# EAGLE schematic video-max5 (EAGLE 5.11)
DRAWN_BY: AlexiosC; PROJECT_NAME: CFT Mini-Computer VDU Card; REVISION: Rev F; SHEET_DESCRIPTION: Video Out; SIMULATION_FILENAME: video.v; URL: http://www.bedroomlan.org/cft

## Sheet 1 of 5
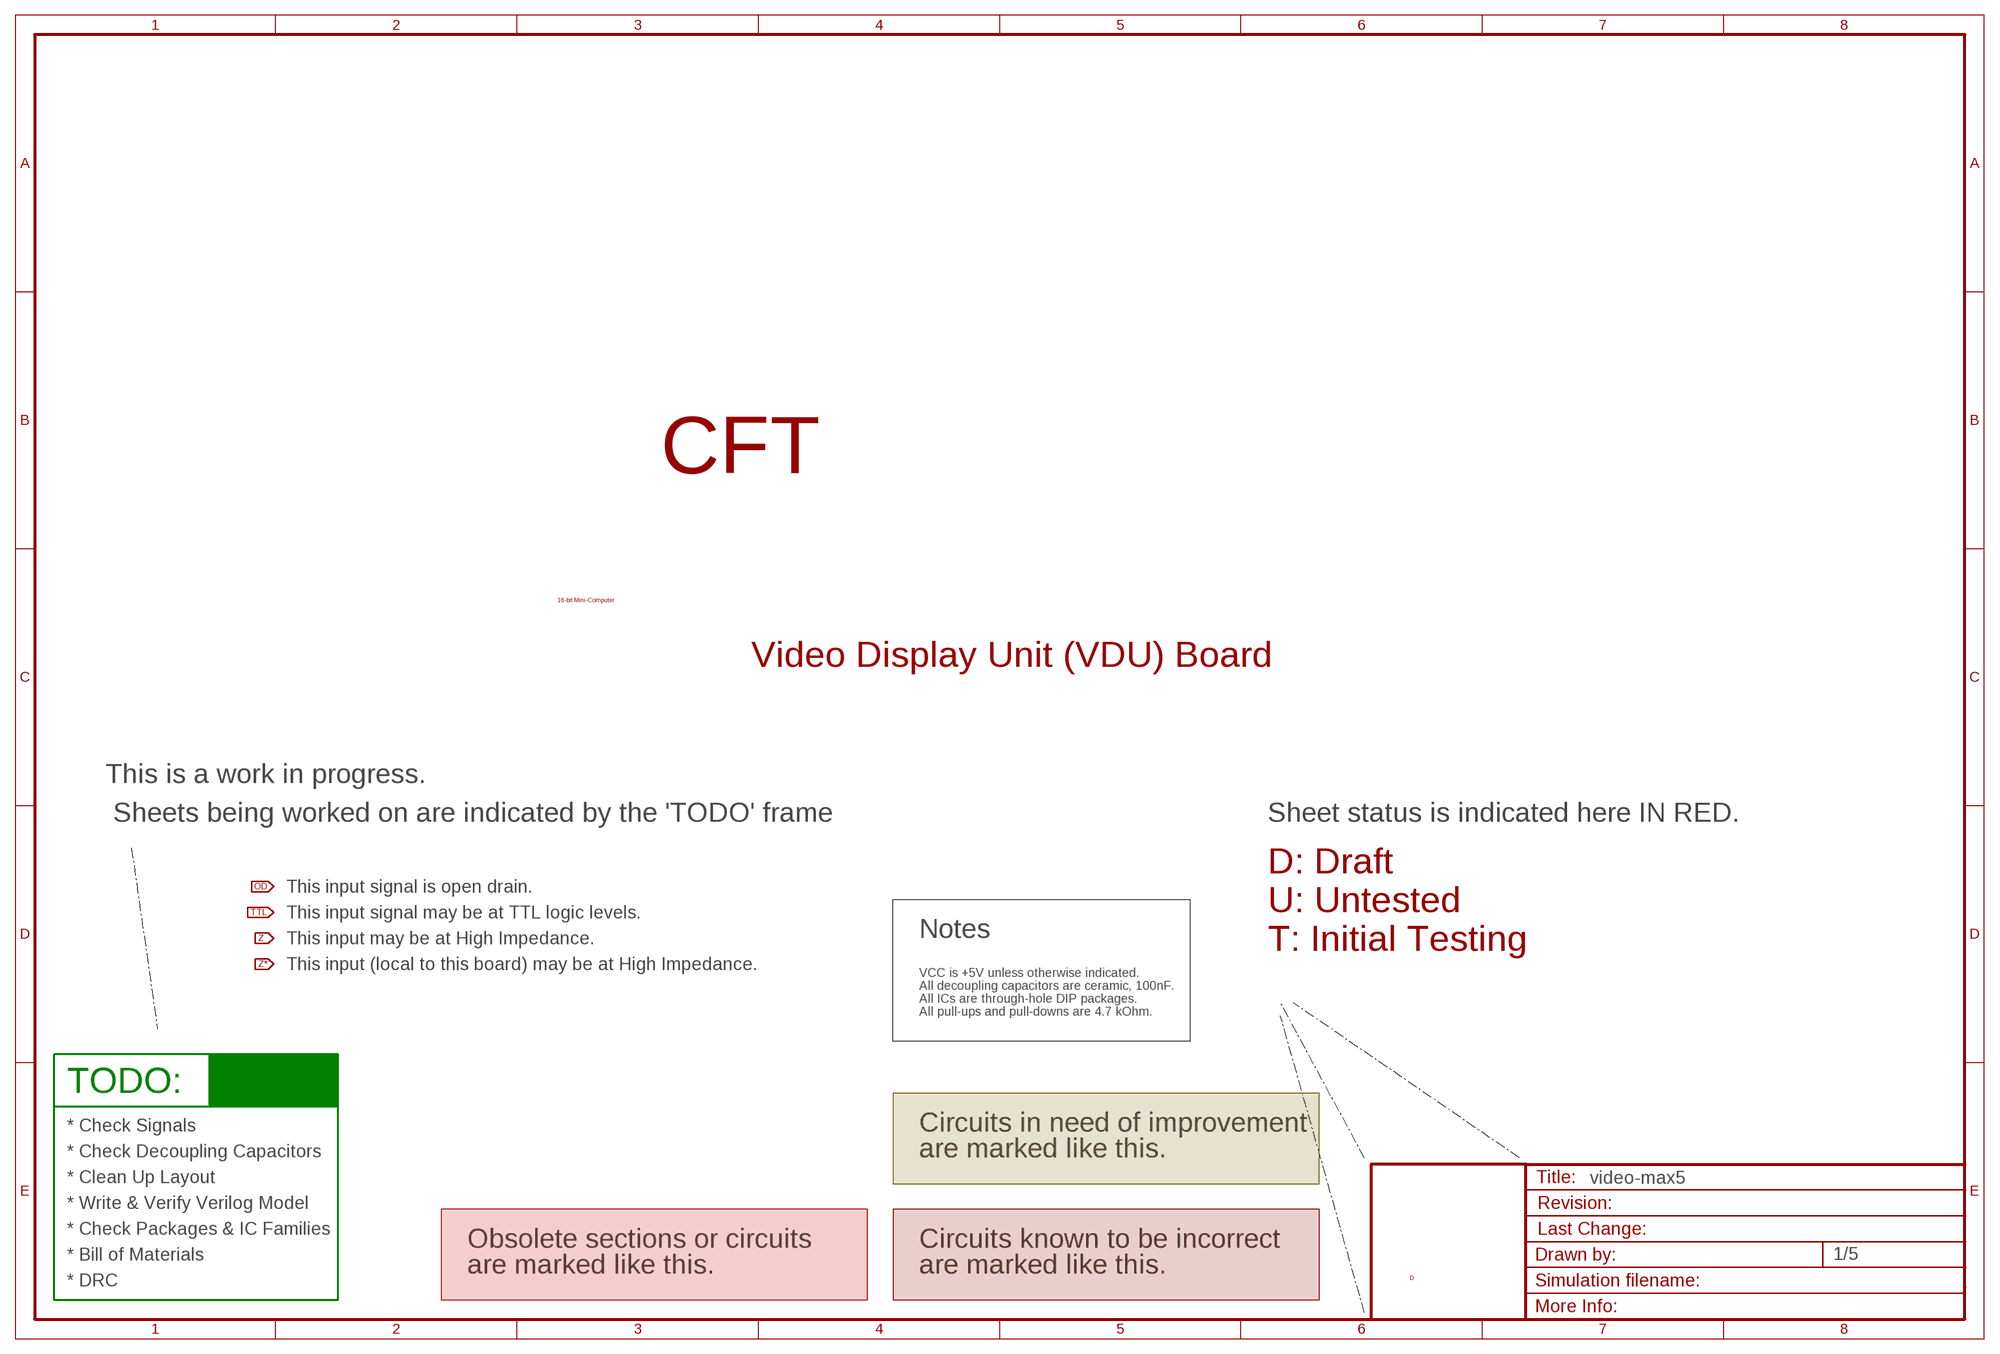
[diagram p0: schematic, sheet 1]

### Notes on the sheet
- CFT
- 16-bit Mini-Computer
- Video Display Unit (VDU) Board
- This is a work in progress.
- Sheets being worked on are indicated by the 'TODO' frame | Sheet status is indicated here IN RED.
- D: Draft
- This input signal is open drain.
- U: Untested
- This input signal may be at TTL logic levels.
- Notes
- This input may be at High Impedance.
- T: Initial Testing
- This input (local to this board) may be at High Impedance.
- VCC is +5V unless otherwise indicated.
- All decoupling capacitors are ceramic, 100nF. | C: Constructed and Tested
- All ICs are through-hole DIP packages.
- All pull-ups and pull-downs are 4.7 kOhm.
- TODO:
- * Check Signals | Circuits in need of improvement
- * Check Decoupling Capacitors | are marked like this.
- * Clean Up Layout
- * Write & Verify Verilog Model
- * Check Packages & IC Families
- Obsolete sections or circuits | Circuits known to be incorrect
- * Bill of Materials
- are marked like this. | are marked like this.
- D
- * DRC

## Sheet 2 of 5
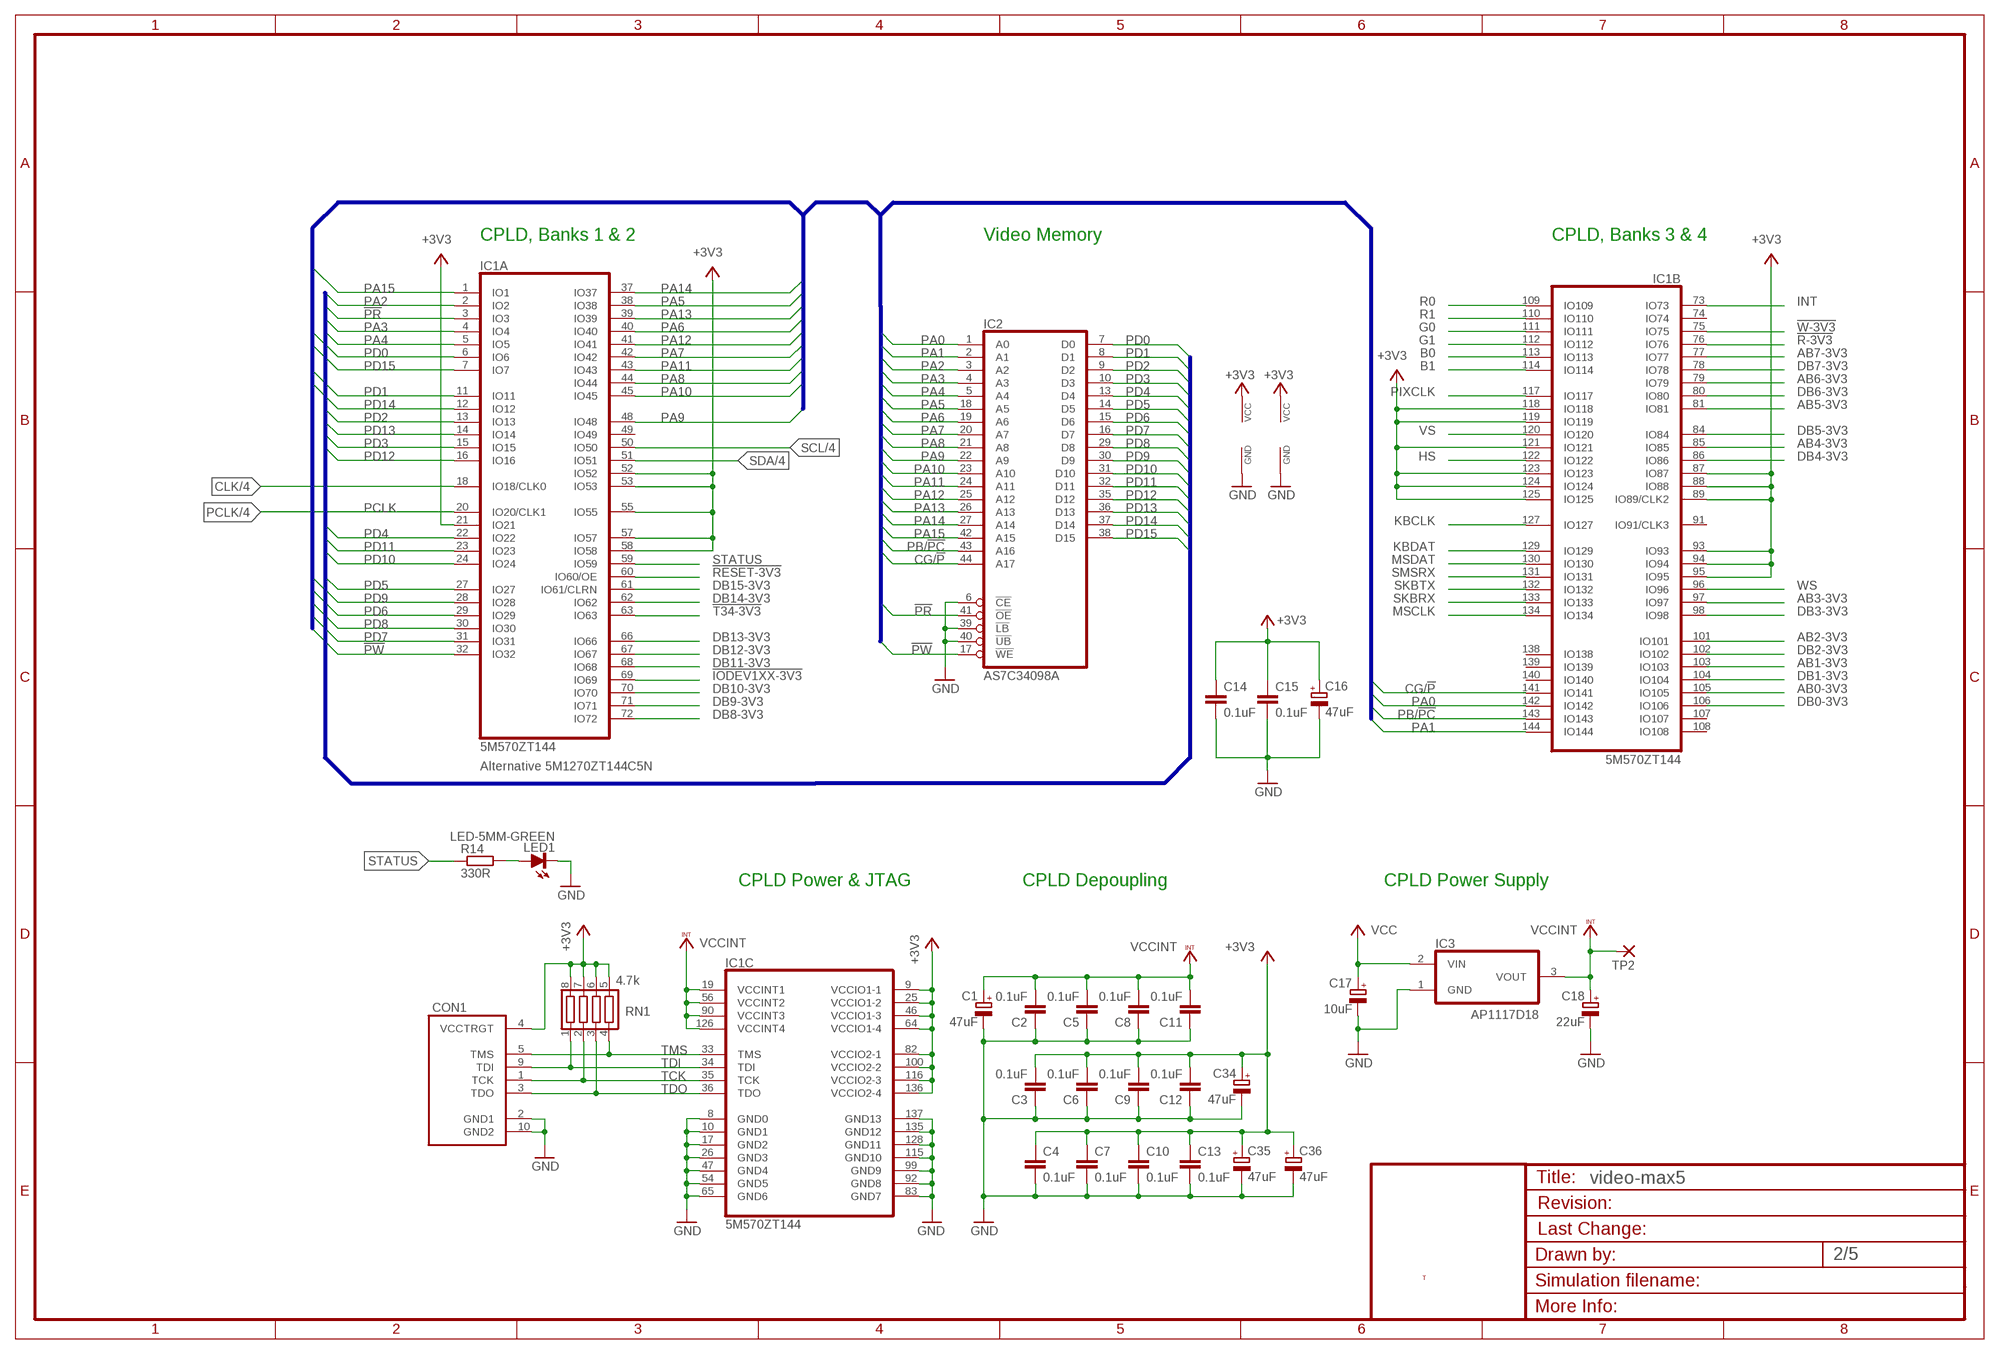
[diagram p1: schematic, sheet 2]

### Parts
C1  47uF  CPOL-EUE2-5  [E2-5]
C2  0.1uF  C-EUC0805K  [C0805K]
C3  0.1uF  C-EUC0805K  [C0805K]
C4  0.1uF  C-EUC0805K  [C0805K]
C5  0.1uF  C-EUC0805K  [C0805K]
C6  0.1uF  C-EUC0805K  [C0805K]
C7  0.1uF  C-EUC0805K  [C0805K]
C8  0.1uF  C-EUC0805K  [C0805K]
C9  0.1uF  C-EUC0805K  [C0805K]
C10  0.1uF  C-EUC0805K  [C0805K]
C11  0.1uF  C-EUC0805K  [C0805K]
C12  0.1uF  C-EUC0805K  [C0805K]
C13  0.1uF  C-EUC0805K  [C0805K]
C14  0.1uF  C-EUC0805K  [C0805K]
C15  0.1uF  C-EUC0805K  [C0805K]
C16  47uF  CPOL-EUE2-5  [E2-5]
C17  10uF  CPOL-EUE2-5  [E2-5]
C18  22uF  CPOL-EUE2-5  [E2-5]
C34  47uF  CPOL-EUE2-5  [E2-5]
C35  47uF  CPOL-EUE2-5  [E2-5]
C36  47uF  CPOL-EUE3.5-8  [E3,5-8]
CON1  JTAG-ALTERA  [SHROUDED-HEADER-2X5-2.5MM]
IC1  5M570ZT144  [TQFP144]
IC2  AS7C34098A  [SOJ44-4]
IC3  AP1117D18  [TO252]
LED1  LED-5MM-GREEN  LEDCHIPLED_0805  [CHIPLED_0805]
R14  330R  R-EU_R0805  [R0805]
RN1  4.7k  CTS742C083  [CTS742C083]
TP2  WIREPAD1,6/0,9  [1,6/0,9]

### Nets
!IODEV1XX-3V3: IC1.69(A:IO69) ; also sheet 4
!PR: IC1.3(A:IO3) IC2.41(!OE)
!PW: IC1.32(A:IO32) IC2.17(!WE)
!R-3V3: IC1.76(B:IO76) ; also sheet 4
!RESET-3V3: IC1.60(A:IO60/OE) ; also sheet 4
!T34-3V3: IC1.63(A:IO63)
!W-3V3: IC1.75(B:IO75) ; also sheet 4
+3V3: C3.2 C4.1 C6.2 C7.1 C9.2 C10.1 C12.2 C13.1 C14.1 C15.1 C16.+ C34.+ C35.+ C36.+ CON1.4(VCCTRGT) IC1.9(C:VCCIO1-1) IC1.21(A:IO21) IC1.25(C:VCCIO1-2) IC1.46(C:VCCIO1-3) IC1.52(A:IO52) IC1.53(A:IO53) IC1.55(A:IO55) IC1.57(A:IO57) IC1.58(A:IO58) IC1.64(C:VCCIO1-4) IC1.82(C:VCCIO2-1) IC1.87(B:IO87) IC1.88(B:IO88) IC1.89(B:IO89/CLK2) IC1.93(B:IO93) IC1.94(B:IO94) IC1.95(B:IO95) IC1.100(C:VCCIO2-2) IC1.116(C:VCCIO2-3) IC1.118(B:IO118) IC1.119(B:IO119) IC1.121(B:IO121) IC1.123(B:IO123) IC1.124(B:IO124) IC1.125(B:IO125) IC1.136(C:VCCIO2-4) IC2.11(VCC) IC2.33(VCC) RN1.5 RN1.6 RN1.7 RN1.8 ; also sheet 3,4,5
AB0-3V3: IC1.105(B:IO105) ; also sheet 4
AB1-3V3: IC1.103(B:IO103) ; also sheet 4
AB2-3V3: IC1.101(B:IO101) ; also sheet 4
AB3-3V3: IC1.97(B:IO97) ; also sheet 4
AB4-3V3: IC1.85(B:IO85) ; also sheet 4
AB5-3V3: IC1.81(B:IO81) ; also sheet 4
AB6-3V3: IC1.79(B:IO79) ; also sheet 4
AB7-3V3: IC1.77(B:IO77) ; also sheet 4
B0: IC1.113(B:IO113) ; also sheet 3
B1: IC1.114(B:IO114) ; also sheet 3
CG/!P!: IC1.141(B:IO141) IC2.44(A17)
CLK: IC1.18(A:IO18/CLK0) ; also sheet 4
DB0-3V3: IC1.106(B:IO106) ; also sheet 4
DB1-3V3: IC1.104(B:IO104) ; also sheet 4
DB2-3V3: IC1.102(B:IO102) ; also sheet 4
DB3-3V3: IC1.98(B:IO98) ; also sheet 4
DB4-3V3: IC1.86(B:IO86) ; also sheet 4
DB5-3V3: IC1.84(B:IO84) ; also sheet 4
DB6-3V3: IC1.80(B:IO80) ; also sheet 4
DB7-3V3: IC1.78(B:IO78) ; also sheet 4
DB8-3V3: IC1.72(A:IO72) ; also sheet 4
DB9-3V3: IC1.71(A:IO71) ; also sheet 4
DB10-3V3: IC1.70(A:IO70) ; also sheet 4
DB11-3V3: IC1.68(A:IO68) ; also sheet 4
DB12-3V3: IC1.67(A:IO67) ; also sheet 4
DB13-3V3: IC1.66(A:IO66) ; also sheet 4
DB14-3V3: IC1.62(A:IO62) ; also sheet 4
DB15-3V3: IC1.61(A:IO61/CLRN) ; also sheet 4
G0: IC1.111(B:IO111) ; also sheet 3
G1: IC1.112(B:IO112) ; also sheet 3
GND: C1.- C2.1 C3.1 C4.2 C5.1 C6.1 C7.2 C8.1 C9.1 C10.2 C11.1 C12.1 C13.2 C14.2 C15.2 C16.- C17.- C18.- C34.- C35.- C36.- CON1.2(GND1) CON1.10(GND2) IC1.8(C:GND0) IC1.10(C:GND1) IC1.17(C:GND2) IC1.26(C:GND3) IC1.47(C:GND4) IC1.54(C:GND5) IC1.65(C:GND6) IC1.83(C:GND7) IC1.92(C:GND8) IC1.99(C:GND9) IC1.115(C:GND10) IC1.128(C:GND11) IC1.135(C:GND12) IC1.137(C:GND13) IC2.6(!CE) IC2.12(GND) IC2.34(GND) IC2.39(!LB) IC2.40(!UB) IC3.1(GND) LED1.C ; also sheet 3,4,5
HS: IC1.122(B:IO122) ; also sheet 3
INT: IC1.73(B:IO73) ; also sheet 4
KBCLK: IC1.127(B:IO127) ; also sheet 4
KBDAT: IC1.129(B:IO129) ; also sheet 4
MSCLK: IC1.134(B:IO134) ; also sheet 4
MSDAT: IC1.130(B:IO130) ; also sheet 4
N$341: LED1.A R14.2
PA0: IC1.142(B:IO142) IC2.1(A0)
PA1: IC1.144(B:IO144) IC2.2(A1)
PA2: IC1.2(A:IO2) IC2.3(A2)
PA3: IC1.4(A:IO4) IC2.4(A3)
PA4: IC1.5(A:IO5) IC2.5(A4)
PA5: IC1.38(A:IO38) IC2.18(A5)
PA6: IC1.40(A:IO40) IC2.19(A6)
PA7: IC1.42(A:IO42) IC2.20(A7)
PA8: IC1.44(A:IO44) IC2.21(A8)
PA9: IC1.48(A:IO48) IC2.22(A9)
PA10: IC1.45(A:IO45) IC2.23(A10)
PA11: IC1.43(A:IO43) IC2.24(A11)
PA12: IC1.41(A:IO41) IC2.25(A12)
PA13: IC1.39(A:IO39) IC2.26(A13)
PA14: IC1.37(A:IO37) IC2.27(A14)
PA15: IC1.1(A:IO1) IC2.42(A15)
PB/!PC!: IC1.143(B:IO143) IC2.43(A16)
PCLK: IC1.20(A:IO20/CLK1) ; also sheet 4
PD0: IC1.6(A:IO6) IC2.7(D0)
PD1: IC1.11(A:IO11) IC2.8(D1)
PD2: IC1.13(A:IO13) IC2.9(D2)
PD3: IC1.15(A:IO15) IC2.10(D3)
PD4: IC1.22(A:IO22) IC2.13(D4)
PD5: IC1.27(A:IO27) IC2.14(D5)
PD6: IC1.29(A:IO29) IC2.15(D6)
PD7: IC1.31(A:IO31) IC2.16(D7)
PD8: IC1.30(A:IO30) IC2.29(D8)
PD9: IC1.28(A:IO28) IC2.30(D9)
PD10: IC1.24(A:IO24) IC2.31(D10)
PD11: IC1.23(A:IO23) IC2.32(D11)
PD12: IC1.16(A:IO16) IC2.35(D12)
PD13: IC1.14(A:IO14) IC2.36(D13)
PD14: IC1.12(A:IO12) IC2.37(D14)
PD15: IC1.7(A:IO7) IC2.38(D15)
PIXCLK: IC1.117(B:IO117) ; also sheet 3
R0: IC1.109(B:IO109) ; also sheet 3
R1: IC1.110(B:IO110) ; also sheet 3
SCL: IC1.50(A:IO50) ; also sheet 4
SDA: IC1.51(A:IO51) ; also sheet 4
SKBRX: IC1.133(B:IO133) ; also sheet 4
SKBTX: IC1.132(B:IO132) ; also sheet 4
SMSRX: IC1.131(B:IO131) ; also sheet 4
STATUS: IC1.59(A:IO59) R14.1
TCK: CON1.1(TCK) IC1.35(C:TCK) RN1.2
TDI: CON1.9(TDI) IC1.34(C:TDI) RN1.1
TDO: CON1.3(TDO) IC1.36(C:TDO) RN1.3
TMS: CON1.5(TMS) IC1.33(C:TMS) RN1.4
VCC: C17.+ IC3.2(VIN) ; also sheet 3,4,5
VCCINT: C1.+ C2.2 C5.2 C8.2 C11.2 C18.+ IC1.19(C:VCCINT1) IC1.56(C:VCCINT2) IC1.90(C:VCCINT3) IC1.126(C:VCCINT4) IC3.3(VOUT) TP2.1(P)
VS: IC1.120(B:IO120) ; also sheet 3
WS: IC1.96(B:IO96) ; also sheet 4
Unconnected: IC1.49(A:IO49) IC1.74(B:IO74) IC1.91(B:IO91/CLK3) IC1.107(B:IO107) IC1.108(B:IO108) IC1.138(B:IO138) IC1.139(B:IO139) IC1.140(B:IO140)

### Buses
PD[0..23]
PA[0..15],PB/!PC!,CG/!P!,!PR,!PW

### Notes on the sheet
- CPLD, Banks 1 & 2 | Video Memory | CPLD, Banks 3 & 4
- Alternative 5M1270ZT144C5N
- CPLD Power & JTAG | CPLD Depoupling | CPLD Power Supply
- T

## Sheet 3 of 5
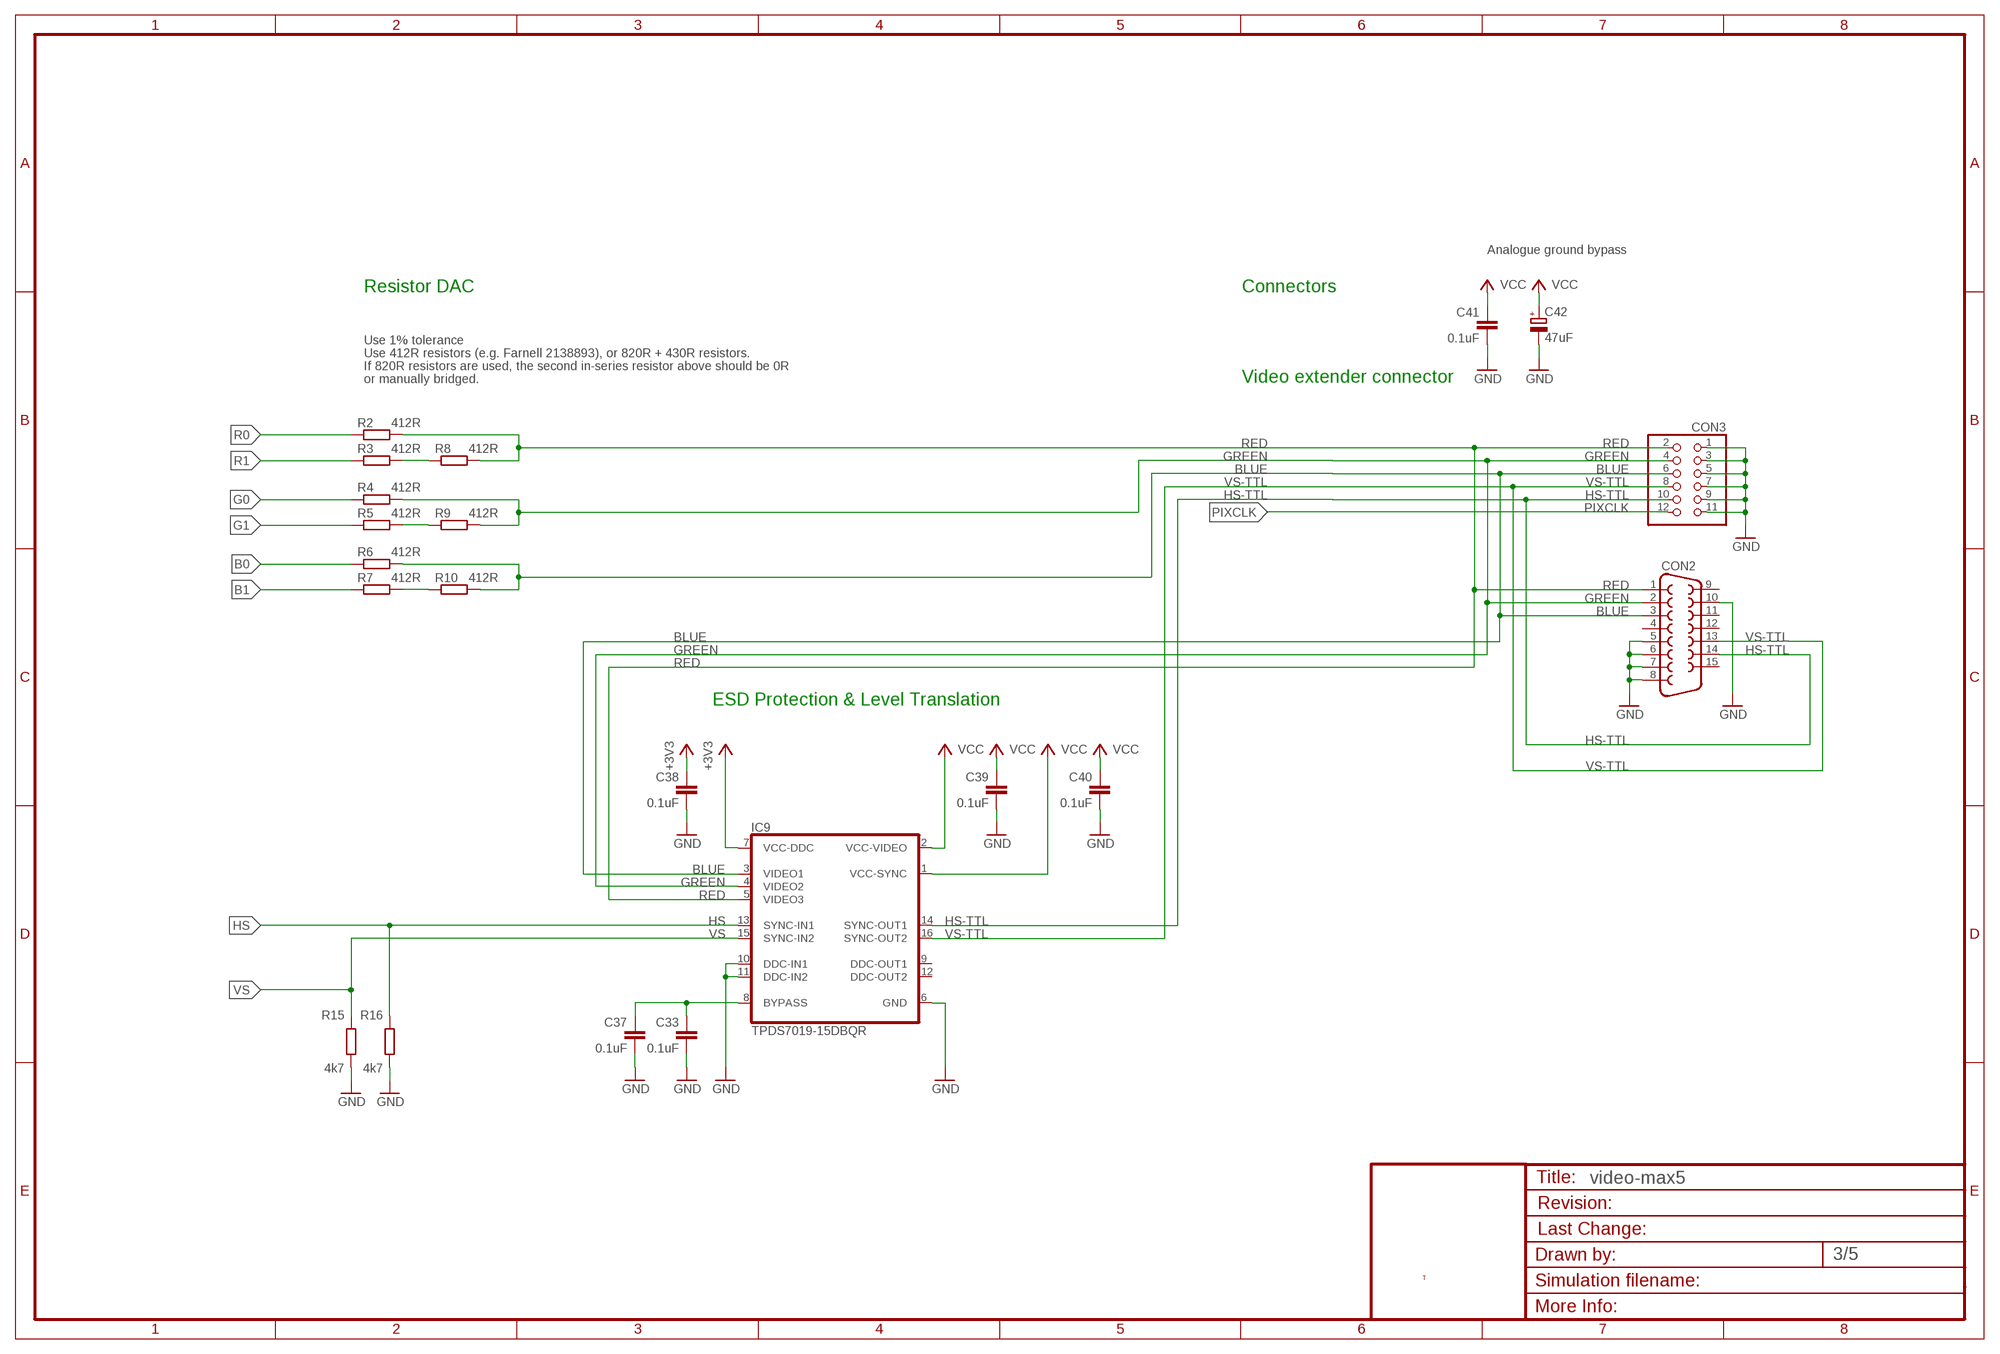
[diagram p2: schematic, sheet 3]

### Parts
C33  0.1uF  C-EUC0805K  [C0805K]
C37  0.1uF  C-EUC0805K  [C0805K]
C38  0.1uF  C-EUC0805K  [C0805K]
C39  0.1uF  C-EUC0805K  [C0805K]
C40  0.1uF  C-EUC0805K  [C0805K]
C41  0.1uF  C-EUC0805K  [C0805K]
C42  47uF  CPOL-EUE2-5  [E2-5]
CON2  F15HDH  [HDF15H]
CON3  PINHD-2X6  [2X06]
IC9  TPDS7019-15DBQR  [SSOP16]
R2  412R  R-EU_R0805  [R0805]
R3  412R  R-EU_R0805  [R0805]
R4  412R  R-EU_R0805  [R0805]
R5  412R  R-EU_R0805  [R0805]
R6  412R  R-EU_R0805  [R0805]
R7  412R  R-EU_R0805  [R0805]
R8  412R  R-EU_R0805  [R0805]
R9  412R  R-EU_R0805  [R0805]
R10  412R  R-EU_R0805  [R0805]
R15  4k7  R-EU_R0805  [R0805]
R16  4k7  R-EU_R0805  [R0805]

### Nets
+3V3: C38.1 IC9.7(VCC-DDC) ; also sheet 2,4,5
B0: R6.1 ; also sheet 2
B1: R7.1 ; also sheet 2
BLUE [Analogue]: CON2.3 CON3.6 IC9.3(VIDEO1) R6.2 R10.2
G0: R4.1 ; also sheet 2
G1: R5.1 ; also sheet 2
GND: C33.2 C37.2 C38.2 C39.2 C40.2 C41.2 C42.- CON2.5 CON2.6 CON2.7 CON2.8 CON2.10 CON3.1 CON3.3 CON3.5 CON3.7 CON3.9 CON3.11 IC9.6(GND) IC9.10(DDC-IN1) IC9.11(DDC-IN2) R15.1 R16.1 ; also sheet 2,4,5
GREEN [Analogue]: CON2.2 CON3.4 IC9.4(VIDEO2) R4.2 R9.2
HS: IC9.13(SYNC-IN1) R16.2 ; also sheet 2
HS-TTL: CON2.14 CON3.10 IC9.14(SYNC-OUT1)
N$1: R3.2 R8.1
N$2: R5.2 R9.1
N$3: R7.2 R10.1
N$6: C33.1 C37.1 IC9.8(BYPASS)
PIXCLK: CON3.12 ; also sheet 2
R0: R2.1 ; also sheet 2
R1: R3.1 ; also sheet 2
RED [Analogue]: CON2.1 CON3.2 IC9.5(VIDEO3) R2.2 R8.2
VCC: C39.1 C40.1 C41.1 C42.+ IC9.1(VCC-SYNC) IC9.2(VCC-VIDEO) ; also sheet 2,4,5
VS: IC9.15(SYNC-IN2) R15.2 ; also sheet 2
VS-TTL: CON2.13 CON3.8 IC9.16(SYNC-OUT2)
Unconnected: CON2.4 CON2.9 CON2.11 CON2.12 CON2.15 IC9.9(DDC-OUT1) IC9.12(DDC-OUT2)

### Notes on the sheet
- Analogue ground bypass
- Resistor DAC | Connectors
- Use 1% tolerance
- Use 412R resistors (e.g. Farnell 2138893), or 820R + 430R resistors.
- If 820R resistors are used, the second in-series resistor above should be 0R
- or manually bridged. | Video extender connector
- ESD Protection & Level Translation
- T

## Sheet 4 of 5
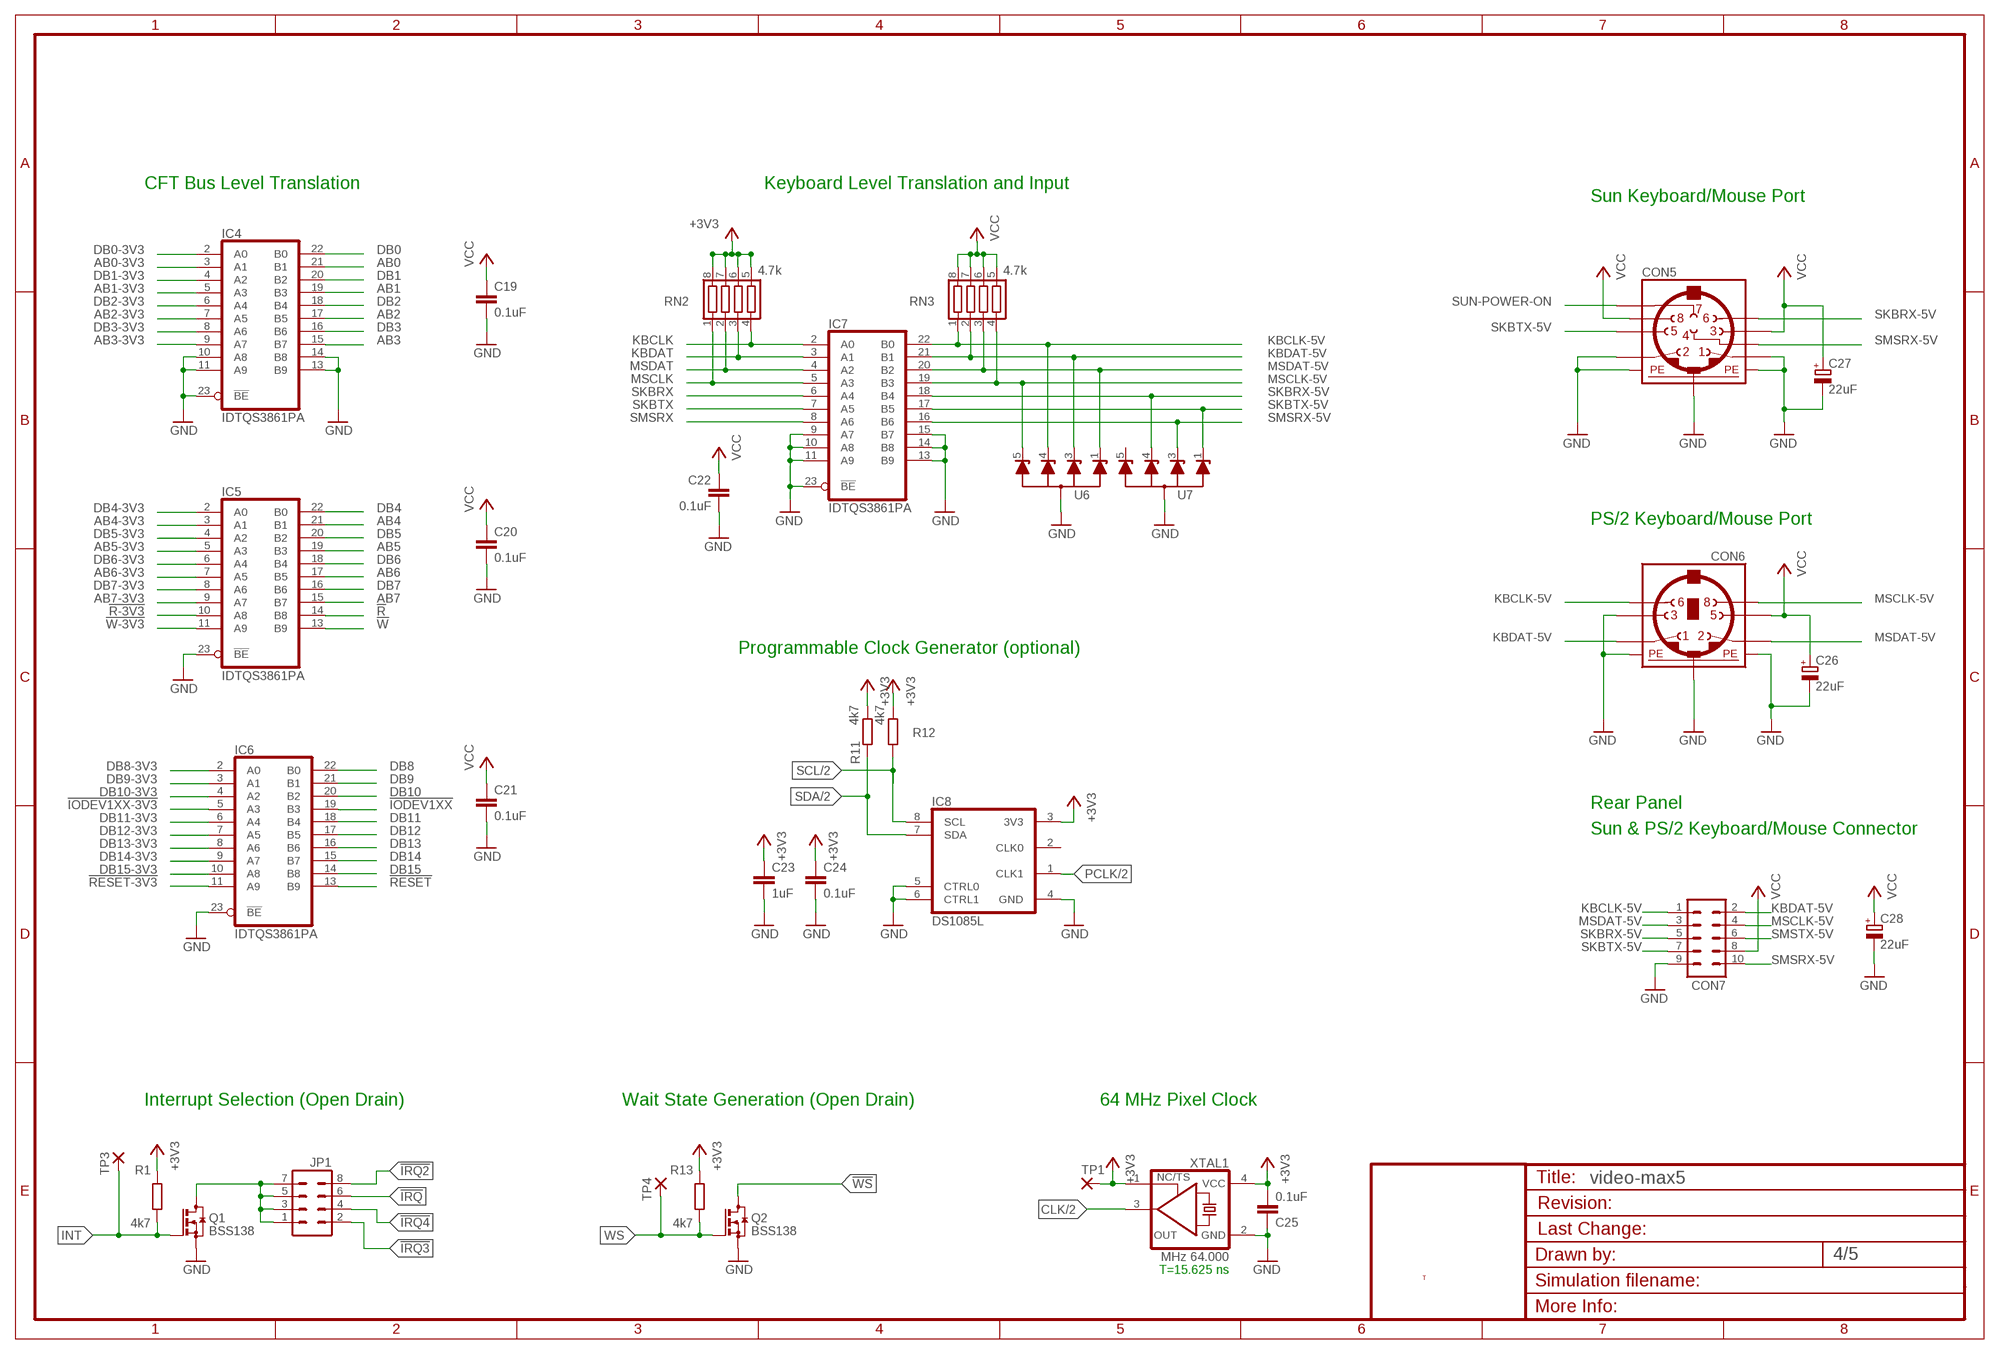
[diagram p3: schematic, sheet 4]

### Parts
C19  0.1uF  C-EUC0805K  [C0805K]
C20  0.1uF  C-EUC0805K  [C0805K]
C21  0.1uF  C-EUC0805K  [C0805K]
C22  0.1uF  C-EUC0805K  [C0805K]
C23  1uF  C-EUC0805K  [C0805K]
C24  0.1uF  C-EUC0805K  [C0805K]
C25  0.1uF  C-EUC0805K  [C0805K]
C26  22uF  CPOL-EUE2-5  [E2-5]
C27  22uF  CPOL-EUE2-5  [E2-5]
C28  22uF  CPOL-EUE2-5  [E2-5]
CON5  MINI_DIN_8  [M_DIN8]
CON6  MINI_DIN_6  [M_DIN6]
CON7  MA05-2  [MA05-2]
IC4  IDTQS3861PA  [TSSOP24]
IC5  IDTQS3861PA  [TSSOP24]
IC6  IDTQS3861PA  [TSSOP24]
IC7  IDTQS3861PA  [TSSOP24]
IC8  DS1085L  [SO08]
JP1  MA04-2  [MA04-2]
Q1  BSS138  [SOT23]
Q2  BSS138  [SOT23]
R1  4k7  R-EU_R0805  [R0805]
R11  4k7  R-EU_R0805  [R0805]
R12  4k7  R-EU_R0805  [R0805]
R13  4k7  R-EU_R0805  [R0805]
RN2  4.7k  CTS742C083  [CTS742C083]
RN3  4.7k  CTS742C083  [CTS742C083]
TP1  WIREPAD1,6/0,9  [1,6/0,9]
TP3  WIREPAD1,6/0,9  [1,6/0,9]
TP4  WIREPAD1,6/0,9  [1,6/0,9]
U6  BZA856AVL  [SC70-5]
U7  BZA856AVL  [SC70-5]
XTAL1  64.000  XO-SMD-5X3.2  [CRYSTAL-SMD-5X3.2MM]

### Nets
!IODEV1XX: IC6.19(B3) ; also sheet 5
!IODEV1XX-3V3: IC6.5(A3) ; also sheet 2
!IRQ: JP1.6 ; also sheet 5
!IRQ2: JP1.8 ; also sheet 5
!IRQ3: JP1.2 ; also sheet 5
!IRQ4: JP1.4 ; also sheet 5
!R: IC5.14(B8) ; also sheet 5
!R-3V3: IC5.10(A8) ; also sheet 2
!RESET: IC6.13(B9) ; also sheet 5
!RESET-3V3: IC6.11(A9) ; also sheet 2
!W: IC5.13(B9) ; also sheet 5
!W-3V3: IC5.11(A9) ; also sheet 2
!WS: Q2.3(D) ; also sheet 5
+3V3: C23.1 C24.1 C25.2 IC8.3(3V3) R1.2 R11.2 R12.2 R13.2 RN2.5 RN2.6 RN2.7 RN2.8 TP1.1(P) XTAL1.1(TS) XTAL1.4(VCC) ; also sheet 2,3,5
AB0: IC4.21(B1) ; also sheet 5
AB0-3V3: IC4.3(A1) ; also sheet 2
AB1: IC4.19(B3) ; also sheet 5
AB1-3V3: IC4.5(A3) ; also sheet 2
AB2: IC4.17(B5) ; also sheet 5
AB2-3V3: IC4.7(A5) ; also sheet 2
AB3: IC4.15(B7) ; also sheet 5
AB3-3V3: IC4.9(A7) ; also sheet 2
AB4: IC5.21(B1) ; also sheet 5
AB4-3V3: IC5.3(A1) ; also sheet 2
AB5: IC5.19(B3) ; also sheet 5
AB5-3V3: IC5.5(A3) ; also sheet 2
AB6: IC5.17(B5) ; also sheet 5
AB6-3V3: IC5.7(A5) ; also sheet 2
AB7: IC5.15(B7) ; also sheet 5
AB7-3V3: IC5.9(A7) ; also sheet 2
CLK: XTAL1.3(OUT) ; also sheet 2
DB0: IC4.22(B0) ; also sheet 5
DB0-3V3: IC4.2(A0) ; also sheet 2
DB1: IC4.20(B2) ; also sheet 5
DB1-3V3: IC4.4(A2) ; also sheet 2
DB2: IC4.18(B4) ; also sheet 5
DB2-3V3: IC4.6(A4) ; also sheet 2
DB3: IC4.16(B6) ; also sheet 5
DB3-3V3: IC4.8(A6) ; also sheet 2
DB4: IC5.22(B0) ; also sheet 5
DB4-3V3: IC5.2(A0) ; also sheet 2
DB5: IC5.20(B2) ; also sheet 5
DB5-3V3: IC5.4(A2) ; also sheet 2
DB6: IC5.18(B4) ; also sheet 5
DB6-3V3: IC5.6(A4) ; also sheet 2
DB7: IC5.16(B6) ; also sheet 5
DB7-3V3: IC5.8(A6) ; also sheet 2
DB8: IC6.22(B0) ; also sheet 5
DB8-3V3: IC6.2(A0) ; also sheet 2
DB9: IC6.21(B1) ; also sheet 5
DB9-3V3: IC6.3(A1) ; also sheet 2
DB10: IC6.20(B2) ; also sheet 5
DB10-3V3: IC6.4(A2) ; also sheet 2
DB11: IC6.18(B4) ; also sheet 5
DB11-3V3: IC6.6(A4) ; also sheet 2
DB12: IC6.17(B5) ; also sheet 5
DB12-3V3: IC6.7(A5) ; also sheet 2
DB13: IC6.16(B6) ; also sheet 5
DB13-3V3: IC6.8(A6) ; also sheet 2
DB14: IC6.15(B7) ; also sheet 5
DB14-3V3: IC6.9(A7) ; also sheet 2
DB15: IC6.14(B8) ; also sheet 5
DB15-3V3: IC6.10(A8) ; also sheet 2
GND: C19.2 C20.2 C21.2 C22.2 C23.2 C24.2 C25.1 C26.- C27.- C28.- CON5.1 CON5.2 CON5.SH1(PE1) CON5.SH2(PE2) CON5.SH3(PE3) CON6.3 CON6.SH1(PE1) CON6.SH2(PE2) CON6.SH3(PE3) CON7.9 IC4.10(A8) IC4.11(A9) IC4.13(B9) IC4.14(B8) IC4.23(!BE) IC5.23(!BE) IC6.23(!BE) IC7.9(A7) IC7.10(A8) IC7.11(A9) IC7.13(B9) IC7.14(B8) IC7.15(B7) IC7.23(!BE) IC8.4(GND) IC8.5(CTRL0) IC8.6(CTRL1) Q1.2(S) Q2.2(S) U6.2(G) U7.2(G) XTAL1.2(GND) ; also sheet 2,3,5
INT: Q1.1(G) R1.1 TP3.1(P) ; also sheet 2
KBCLK: IC7.2(A0) RN2.4 ; also sheet 2
KBCLK-5V: CON6.6 CON7.1 IC7.22(B0) RN3.1 U6.4
KBDAT: IC7.3(A1) RN2.3 ; also sheet 2
KBDAT-5V: CON6.1 CON7.2 IC7.21(B1) RN3.2 U6.3
MSCLK: IC7.5(A3) RN2.1 ; also sheet 2
MSCLK-5V: CON6.8 CON7.4 IC7.19(B3) RN3.4 U6.5
MSDAT: IC7.4(A2) RN2.2 ; also sheet 2
MSDAT-5V: CON6.2 CON7.3 IC7.20(B2) RN3.3 U6.1
N$4: JP1.1 JP1.3 JP1.5 JP1.7 Q1.3(D)
PCLK: IC8.1(CLK1) ; also sheet 2
SCL: IC8.8(SCL) R12.1 ; also sheet 2
SDA: IC8.7(SDA) R11.1 ; also sheet 2
SKBRX: IC7.6(A4) ; also sheet 2
SKBRX-5V: CON5.6 CON7.5 IC7.18(B4) U7.4
SKBTX: IC7.7(A5) ; also sheet 2
SKBTX-5V: CON5.5 CON7.7 IC7.17(B5) U7.1
SMSRX: IC7.8(A6) ; also sheet 2
SMSRX-5V: CON5.4 CON7.10 IC7.16(B6) U7.3
SMSTX-5V: CON7.6
SUN-POWER-ON: CON5.7
VCC: C19.1 C20.1 C21.1 C22.1 C26.+ C27.+ C28.+ CON5.3 CON5.8 CON6.5 CON7.8 RN3.5 RN3.6 RN3.7 RN3.8 ; also sheet 2,3,5
WS: Q2.1(G) R13.1 TP4.1(P) ; also sheet 2
Unconnected: IC8.2(CLK0) U7.5

### Notes on the sheet
- CFT Bus Level Translation | Keyboard Level Translation and Input
- Sun Keyboard/Mouse Port
- PS/2 Keyboard/Mouse Port
- Programmable Clock Generator (optional)
- Rear Panel
- Sun & PS/2 Keyboard/Mouse Connector
- Interrupt Selection (Open Drain) | Wait State Generation (Open Drain) | 64 MHz Pixel Clock
- MHz
- T=15.625 ns
- T

## Sheet 5 of 5
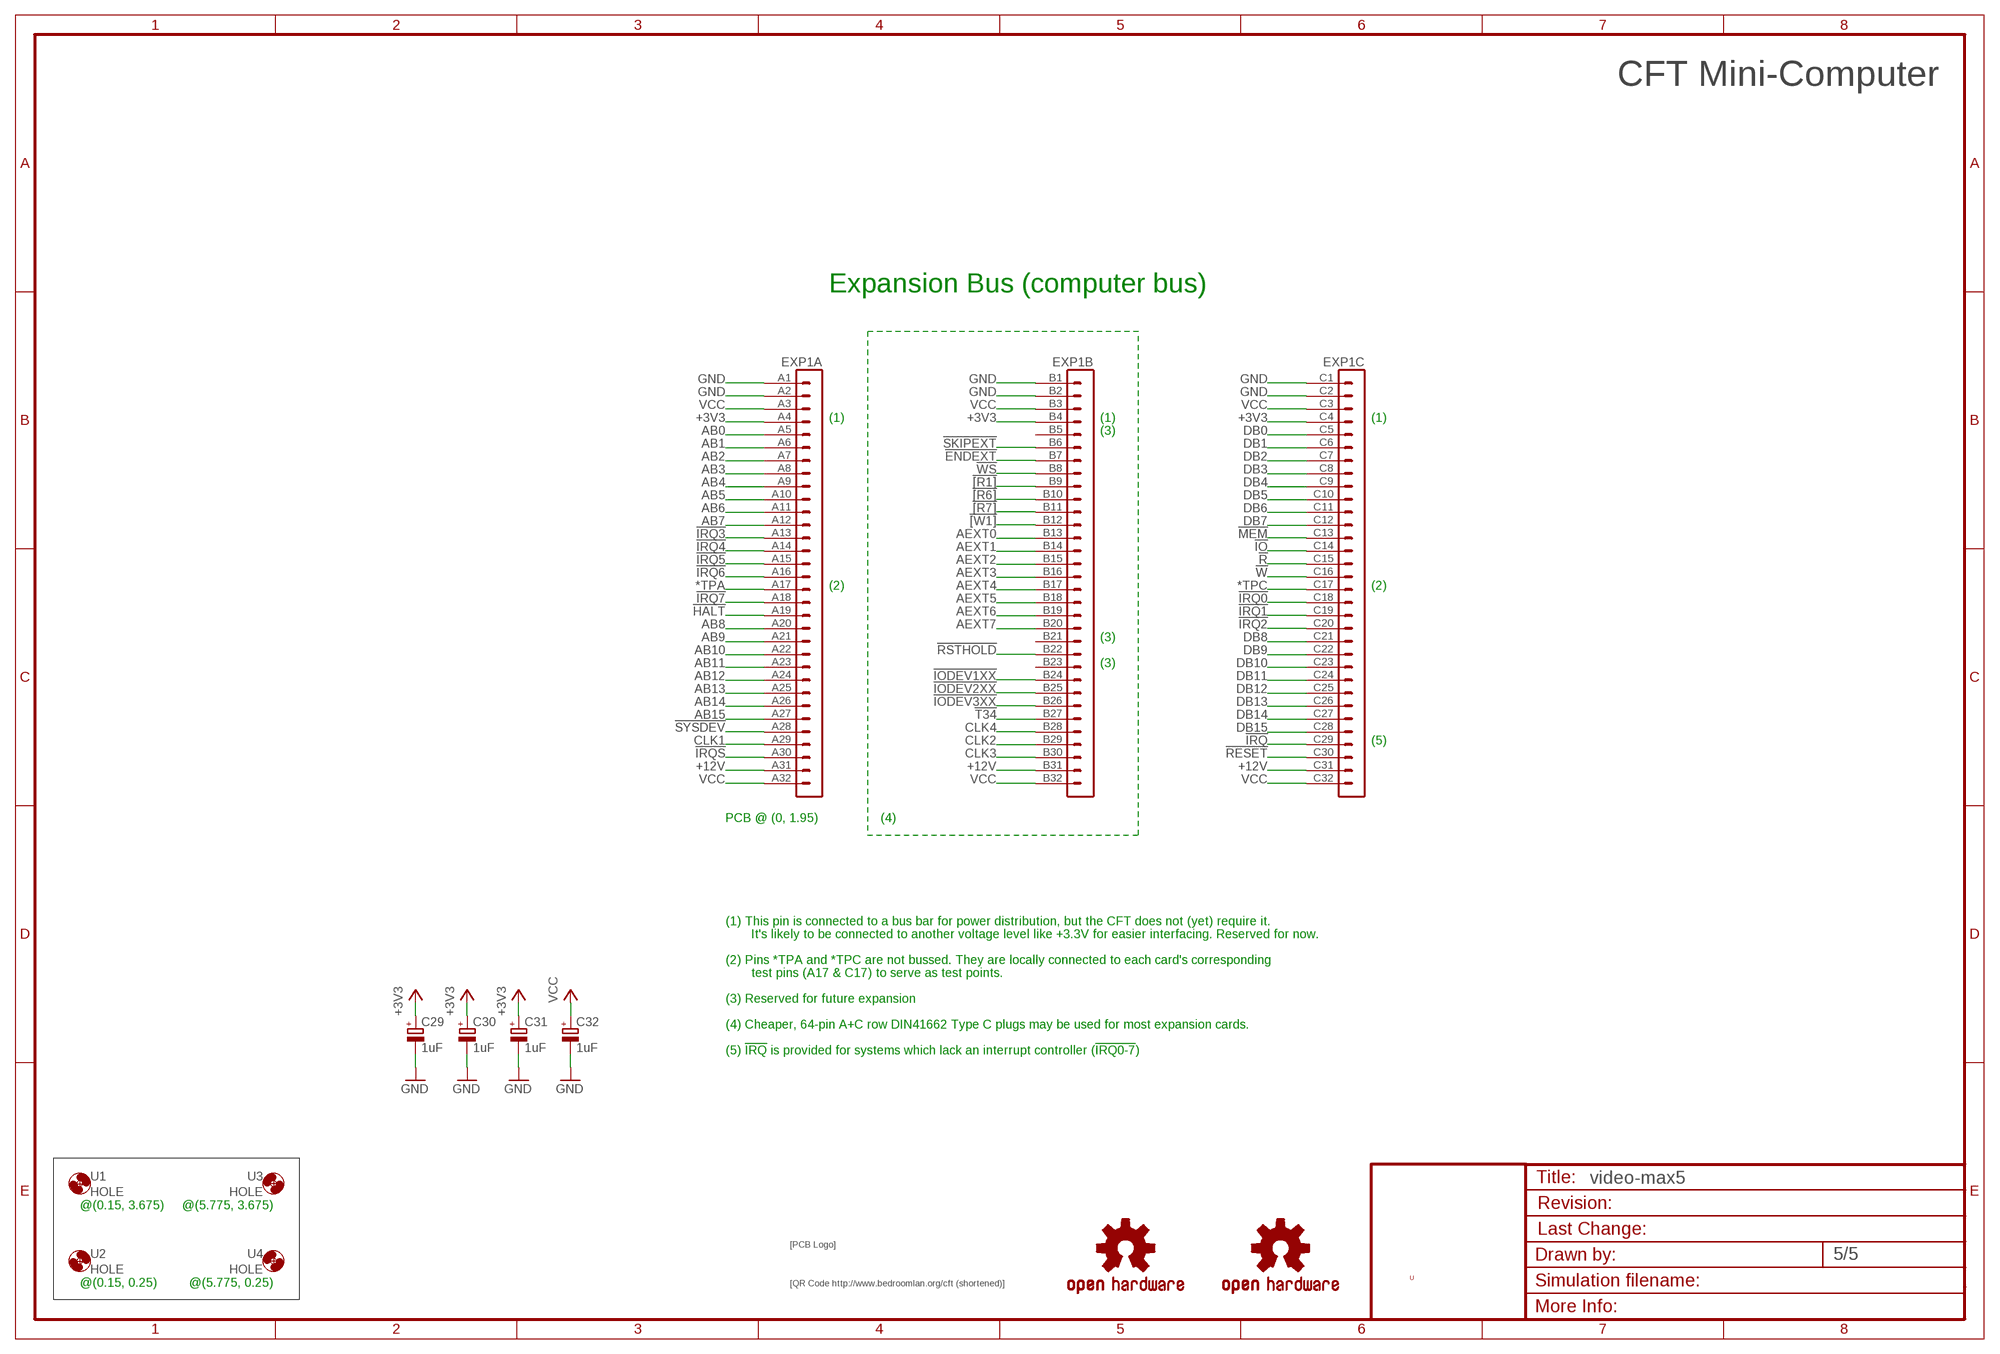
[diagram p4: schematic, sheet 5]

### Parts
$4_37_$1  SIGNATURESILK  [SIGNATURE]
$4_39_$  OSHW-LOGOL  [OSHW-LOGO-L]
$4_39_$1  OSHW-LOGOL  [OSHW-LOGO-L]
$4_40_$  QRCODE-CFT  [CFT-QRCODE]
C29  1uF  CPOL-EUE2.5-5  [E2,5-5]
C30  1uF  CPOL-EUE2.5-5  [E2,5-5]
C31  1uF  CPOL-EUE2.5-5  [E2,5-5]
C32  1uF  CPOL-EUE2.5-5  [E2,5-5]
EXP1  VG96-3K  [VG96K]
U1  HOLE  [STANDOFF_28_60]
U2  HOLE  [STANDOFF_28_60]
U3  HOLE  [STANDOFF_28_60]
U4  HOLE  [STANDOFF_28_60]

### Nets
![R1]: EXP1.B9
![R6]: EXP1.B10
![R7]: EXP1.B11
![W1]: EXP1.B12
!ENDEXT: EXP1.B7
!HALT: EXP1.A19
!IO: EXP1.C14
!IODEV1XX: EXP1.B24 ; also sheet 4
!IODEV2XX: EXP1.B25
!IODEV3XX: EXP1.B26
!IRQ: EXP1.C29 ; also sheet 4
!IRQ0: EXP1.C18
!IRQ1: EXP1.C19
!IRQ2: EXP1.C20 ; also sheet 4
!IRQ3: EXP1.A13 ; also sheet 4
!IRQ4: EXP1.A14 ; also sheet 4
!IRQ5: EXP1.A15
!IRQ6: EXP1.A16
!IRQ7: EXP1.A18
!IRQS: EXP1.A30
!MEM: EXP1.C13
!R: EXP1.C15 ; also sheet 4
!RESET: EXP1.C30 ; also sheet 4
!RSTHOLD: EXP1.B22
!SKIPEXT: EXP1.B6
!SYSDEV: EXP1.A28
!T34: EXP1.B27
!W: EXP1.C16 ; also sheet 4
!WS: EXP1.B8 ; also sheet 4
*TPA: EXP1.A17
*TPC: EXP1.C17
+3V3: C29.+ C30.+ C31.+ EXP1.A4 EXP1.B4 EXP1.C4 ; also sheet 2,3,4
+12V [Power Rail]: EXP1.A31 EXP1.B31 EXP1.C31
AB0: EXP1.A5 ; also sheet 4
AB1: EXP1.A6 ; also sheet 4
AB2: EXP1.A7 ; also sheet 4
AB3: EXP1.A8 ; also sheet 4
AB4: EXP1.A9 ; also sheet 4
AB5: EXP1.A10 ; also sheet 4
AB6: EXP1.A11 ; also sheet 4
AB7: EXP1.A12 ; also sheet 4
AB8: EXP1.A20
AB9: EXP1.A21
AB10: EXP1.A22
AB11: EXP1.A23
AB12: EXP1.A24
AB13: EXP1.A25
AB14: EXP1.A26
AB15: EXP1.A27
AEXT0: EXP1.B13
AEXT1: EXP1.B14
AEXT2: EXP1.B15
AEXT3: EXP1.B16
AEXT4: EXP1.B17
AEXT5: EXP1.B18
AEXT6: EXP1.B19
AEXT7: EXP1.B20
CLK1: EXP1.A29
CLK2: EXP1.B29
CLK3: EXP1.B30
CLK4: EXP1.B28
DB0: EXP1.C5 ; also sheet 4
DB1: EXP1.C6 ; also sheet 4
DB2: EXP1.C7 ; also sheet 4
DB3: EXP1.C8 ; also sheet 4
DB4: EXP1.C9 ; also sheet 4
DB5: EXP1.C10 ; also sheet 4
DB6: EXP1.C11 ; also sheet 4
DB7: EXP1.C12 ; also sheet 4
DB8: EXP1.C21 ; also sheet 4
DB9: EXP1.C22 ; also sheet 4
DB10: EXP1.C23 ; also sheet 4
DB11: EXP1.C24 ; also sheet 4
DB12: EXP1.C25 ; also sheet 4
DB13: EXP1.C26 ; also sheet 4
DB14: EXP1.C27 ; also sheet 4
DB15: EXP1.C28 ; also sheet 4
GND: C29.- C30.- C31.- C32.- EXP1.A1 EXP1.A2 EXP1.B1 EXP1.B2 EXP1.C1 EXP1.C2 ; also sheet 2,3,4
VCC: C32.+ EXP1.A3 EXP1.A32 EXP1.B3 EXP1.B32 EXP1.C3 EXP1.C32 ; also sheet 2,3,4
Unconnected: EXP1.B5 EXP1.B21 EXP1.B23

### Notes on the sheet
- CFT Mini-Computer
- Expansion Bus (computer bus)
- (1) | (1) | (1)
- (3)
- (2) | (2)
- (3)
- (3)
- (5)
- PCB @ (0, 1.95) | (4)
- (1) This pin is connected to a bus bar for power distribution, but the CFT does not (yet) require it.
- It's likely to be connected to another voltage level like +3.3V for easier interfacing. Reserved for now.
- (2) Pins *TPA and *TPC are not bussed. They are locally connected to each card's corresponding
- test pins (A17 & C17) to serve as test points.
- (3) Reserved for future expansion
- (4) Cheaper, 64-pin A+C row DIN41662 Type C plugs may be used for most expansion cards.
- (5) !IRQ! is provided for systems which lack an interrupt controller (!IRQ0-7!)
- @(0.15, 3.675) | @(5.775, 3.675)
- U
- @(0.15, 0.25) | @(5.775, 0.25)

## Power pins joined to a net without a drawn wire
GND: IC4.12(GND) IC5.12(GND) IC6.12(GND) IC7.12(GND)
VCC: IC4.24(VCC) IC5.24(VCC) IC6.24(VCC) IC7.24(VCC)

## Library data of the parts
$4_37_$1 = alexios:SIGNATURE: Soup signature
$4_39_$ $4_39_$1 = SparkFun:OSHW-LOGO: Open Source Hardware Logo This logo indicates the piece of hardware it is found on incorporates a OSHW license and/or adheres to the definition of open source hardware found here: http://freedomdefined.org/OSHW
$4_40_$ = alexios:QRCODE-*: Various QR codes in silkscreen.
C1 C16-C18 C26-C32 C34-C36 C42 = rcl:CPOL-EU: POLARIZED CAPACITOR, European symbol
C2-C15 C19-C25 C33 C37-C41 = rcl:C-EU: CAPACITOR, European symbol
CON1 = alexios:JTAG-ALTERA: Altera JTAG suitable for a USB Blaster (2×5 pin male header)
CON2 = con-subd:F15: SUB-D; OC_FARNELL: unknown; OC_NEWARK: unknown
CON3 = pinhead:PINHD-2X6: PIN HEADER
CON5 = mini_din:MINI_DIN_8
CON6 = mini_din:MINI_DIN_6
CON7 = con-lstb:MA05-2: PIN HEADER; OC_FARNELL: unknown; OC_NEWARK: unknown
EXP1 = alexios-19inch:VG96-3: PCB EUROCARD, 96-pin type C/ABC, 2.54 mm
IC1 = alexios:5M*: Altera MAX V CPLD, 570 Logic Elements
IC2 = alexios:AS7C34098A: 3.3 V 256 K × 16 CMOS SRAM Datasheet: http://www.farnell.com/datasheets/32806.pdf Farnell: 1562919 <http://export.farnell.com/alliance-memory/as7c34098a-12jin/sram-4mb-3v-12ns-256kx16-soj44/dp/1562919> Features ? Pin compatible with AS7C34098 ? Industrial and commercial temperature ? Organization: 262,144 words × 16 bits ? Center power and ground pins ? High speed - 10/12/15/20 ns address access time - 4/5/6/7 ns output enable access time ? Low power consumption: ACTIVE - 650 mW /max @ 10 ns ? Low power consumption: STANDBY - 28.8 mW /max CMOS ? Individual byte read/write controls ? Easy memory expansion with CE, OE inputs ? TTL- and CMOS-compatible, three-state I/O ? 44-pin JEDEC standard packages - 400-mil SOJ - TSOP 2 ? ESD protection ? 2000 volts ? Latch-up current ? 200 mA
IC3 = alexios:AP1117: 1A LOW DROPOUT (LDO) POSITIVE FIXED-MODE REGULATOR http://www.farnell.com/datasheets/608751.pdf
IC4-IC7 = alexios:IDTQS3861: IDT QuickSwitch® High Speed CMOS Bus Switch with Flow-Through Pinout http://www.idt.com/products/memory-logic/bus-switch/50v-quickswitch/qs3861-high-speed-cmos-10-bit-bus-switch-flow-thru-pinout
IC8 = alexios:DS1085L: Programmable clock generator (4 kHz to 66 MHz) Datasheet: http://www.mouser.com/ds/2/256/DS1085L-29930.pdf Mouser: 700-DS1085LZ-25
IC9 = alexios:TPDS7019: 7-CHANNEL INTEGRATED ESD SOLUTION FOR VGA PORT WITH INTEGRATED LEVEL SHIFTER AND MATCHING IMPEDANCE Datasheet: http://www.mouser.com/ds/2/405/sllse33b-261401.pdf Mouser: 595-TPD7S019-15DBQR
JP1 = con-lstb:MA04-2: PIN HEADER; OC_FARNELL: unknown; OC_NEWARK: unknown
LED1 = alexios:LED: LED OSRAM: - CHIPLED LG R971, LG N971, LY N971, LG Q971, LY Q971, LO R971, LY R971 LH N974, LH R974 LS Q976, LO Q976, LY Q976 LO Q996 - Hyper CHIPLED LW Q18S LB Q993, LB Q99A, LB R99A - SideLED LS A670, LO A670, LY A670, LG A670, LP A670 LB A673, LV A673, LT A673, LW A673 LH A674 LY A675 LS A676, LA A676, LO A676, LY A676, LW A676 LS A679, LY A679, LG A679 - Hyper Micro SIDELED® LS Y876, LA Y876, LO Y876, LY Y876 LT Y87S - SmartLED LW L88C, LW L88S LB L89C, LB L89S, LG L890 LS L89K, LO L89K, LY L89K LS L896, LA L896, LO L896, LY L896 - TOPLED LS T670, LO T670, LY T670, LG T670, LP T670 LSG T670, LSP T670, LSY T670, LOP T670, LYG T670 LG T671, LOG T671, LSG T671 LB T673, LV T673, LT T673, LW T673 LH T674 LS T676, LA T676, LO T676, LY T676, LB T676, LH T676, LSB T676, LW T676 LB T67C, LV T67C, LT T67C, LS T67K, LO T67K, LY T67K, LW E67C LS E67B, LA E67B, LO E67B, LY E67B, LB E67C, LV E67C, LT E67C LW T67C LS T679, LY T679, LG T679 LS T770, LO T770, LY T770, LG T770, LP T770 LB T773, LV T773, LT T773, LW T773 LH T774 LS E675, LA E675, LY E675, LS T675 LS T776, LA T776, LO T776, LY T776, LB T776 LHGB T686 LT T68C, LB T68C - Hyper Mini TOPLED® LB M676 - Mini TOPLED Santana® LG M470 LS M47K, LO M47K, LY M47K Source: http://www.osram.convergy.de LUXEON: - LUMILED® LXK2-PW12-R00, LXK2-PW12-S00, LXK2-PW14-U00, LXK2-PW14-V00 LXK2-PM12-R00, LXK2-PM12-S00, LXK2-PM14-U00 LXK2-PE12-Q00, LXK2-PE12-R00, LXK2-PE12-S00, LXK2-PE14-T00, LXK2-PE14-U00 LXK2-PB12-K00, LXK2-PB12-L00, LXK2-PB12-M00, LXK2-PB14-N00, LXK2-PB14-P00, LXK2-PB14-Q00 LXK2-PR12-L00, LXK2-PR12-M00, LXK2-PR14-Q00, LXK2-PR14-R00 LXK2-PD12-Q00, LXK2-PD12-R00, LXK2-PD12-S00 LXK2-PH12-R00, LXK2-PH12-S00 LXK2-PL12-P00, LXK2-PL12-Q00, LXK2-PL12-R00 Source: www.luxeon.com KINGBRIGHT: KA-3528ASYC Source: www.kingbright.com
Q1 Q2 = alexios:BSS138: N-CHANNEL MOS FET Datasheet: http://www.mouser.com/ds/2/302/BSS138BK-111392.pdf Mouser: 771-BSS138BK215
R1 R11-R16 = resistor:R-EU_: RESISTOR, European symbol
R2-R10 = rcl:R-EU_: RESISTOR, European symbol
RN1-RN3 = resistor-net:CTS742C083: Chip Resistor Array 4 Single Resistor Source: http://www.ctscorp.com/components/Datasheets/CTSChipArrayDs.pdf; OC_FARNELL: unknown; OC_NEWARK: unknown
TP1-TP4 = wirepad:WIREPAD: Wire PAD connect wire on PCB
U1-U4 = alexios:HOLE: Hole for a standoff or mount. Hole diameter: 3.3mm. External Diameter: 6mm. Suitable for M3 standoffs.
U6 U7 = alexios:BZA856AVL: NXP Quadruple low capacitance ESD suppressor Datasheet: http://www.mouser.com/ds/2/302/BZA800AVL_SERIES-114602.pdf Mouser: 771-BZA856AVL115
XTAL1 = alexios:XO-: Crystal Oscillator for DIP sockets Crystal oscillators in DIP8 or DIP14 packages with sockets. Drills extra holes on the PCB to allow a standard DIP8 or DIP14 socket to be installed.

## Net classes
0 default: width 0.254 mm, clearance 0.152 mm
1 low power: width 1.27 mm, clearance 0.203 mm
2 Power Rail: width 0.61 mm, clearance 0.254 mm
3 3.3V power: width 0.61 mm, clearance 0.203 mm
4 Analogue: width 0.406 mm, clearance 0.203 mm